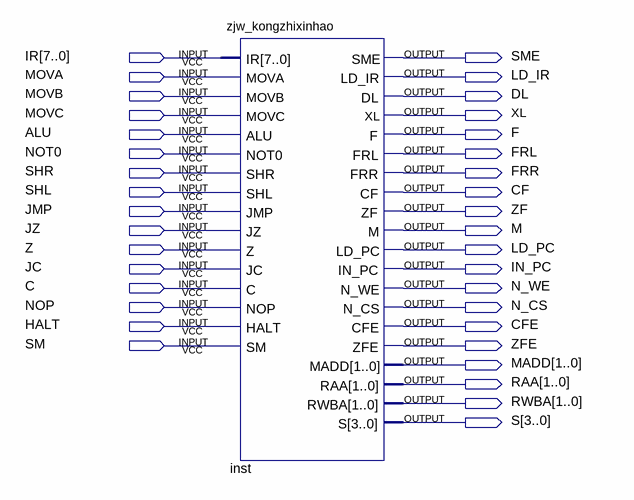
[diagram p0: schematic sheet]
// Quartus schematic Block1.bdf as structural Verilog: 1 symbols, 36 pins
module Block1 (
  input  [7:0] IR,
  input  MOVA,
  input  MOVB,
  input  MOVC,
  input  ALU,
  input  NOT0,
  input  SHR,
  input  SHL,
  input  JMP,
  input  JZ,
  input  Z,
  input  JC,
  input  C,
  input  NOP,
  input  HALT,
  input  SM,
  output SME,
  output LD_IR,
  output DL,
  output XL,
  output F,
  output FRL,
  output FRR,
  output CF,
  output ZF,
  output M,
  output LD_PC,
  output IN_PC,
  output N_WE,
  output N_CS,
  output CFE,
  output ZFE,
  output [1:0] MADD,
  output [1:0] RAA,
  output [1:0] RWBA,
  output [3:0] S
);

  zjw_kongzhixinhao inst (
    .IR(IR), .MOVA(MOVA), .MOVB(MOVB), .MOVC(MOVC), .ALU(ALU), .NOT0(NOT0), .SHR(SHR), .SHL(SHL), .JMP(JMP),
    .JZ(JZ), .Z(Z), .JC(JC), .C(C), .NOP(NOP), .HALT(HALT), .SM(SM), .SME(SME), .LD_IR(LD_IR), .DL(DL),
    .XL(XL), .F(F), .FRL(FRL), .FRR(FRR), .CF(CF), .ZF(ZF), .M(M), .LD_PC(LD_PC), .IN_PC(IN_PC), .N_WE(N_WE),
    .N_CS(N_CS), .CFE(CFE), .ZFE(ZFE), .MADD(MADD), .RAA(RAA), .RWBA(RWBA), .S(S));
endmodule
